# Altium project sEMG_sensor.PrjPcb
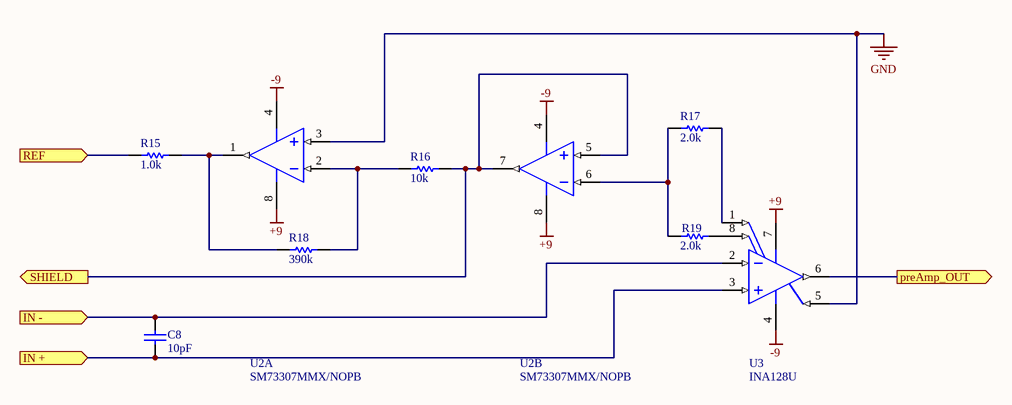
[diagram p0: PreAmplifier.SchDoc]
2 sheets, 29 parts. Net scope: flat (ports and power ports of the same name join across sheets).
Board file: sEMG_sensor_V1.PcbDoc
Sheets:
  PreAmplifier.SchDoc
  BandPassFilter.SchDoc

## Sheet PreAmplifier.SchDoc
size A

### Parts
C8  value 10pF  [0402cap]  (hidden comment: C0402)
R15  value 1.0k  [0402RES]  (hidden comment: R0402)
R16  value 10k  [0402RES]  (hidden comment: R0402)
R17  value 2.0k  [0402RES]  (hidden comment: R0402)
R18  value 390k  [0402RES]  (hidden comment: R0402)
R19  value 2.0k  [0402RES]  (hidden comment: R0402)
U2  SM73307MMX/NOPB  [MUA08A_N]  (parts A,B of 2)
U3  INA128U  [TI-D8_N]

### Ports
IN + (in), IN - (in), preAmp_OUT (out), REF (in), SHIELD (out)

### Nets
+9: U2.8(V+) U3.7(V+)
-9: U2.4(V-) U3.4(V-)
GND: U2.3(INA+) U3.5(REF)
NetC4_2: U3.6(VO) ; port preAmp_OUT
NetC8_1: C8.1 U3.3(VIN+) ; port IN +
NetC8_2: C8.2 U3.2(VIN-) ; port IN -
NetR15_1: R15.1 ; port REF
NetR15_2: R15.2 R18.1 U2.1(OUTA)
NetR16_1: R16.1 R18.2 U2.2(INA-)
NetR16_2: R16.2 U2.5(INB+) U2.7(OUTB) ; port SHIELD
NetR17_1: R17.1 R19.1 U2.6(INB-)
NetR17_2: R17.2 U3.1(RG)
NetR19_2: R19.2 U3.8(RG)

### Library data of the parts
C8 = C0402: 0402 Ceramic Chip Capacitor - Standard
R15-R19 = R0402: 0402 Chip Resistor - Standard; ComponentLink1URL: *
U2 = SM73307MMX/NOPB: Dual Precision, 17 MHz, Low Noise, CMOS Input Amplifier, 8-pin Mini SOIC, 3500 Reel; Manufacturer: National Semiconductor; PackageTopMarking: ZXTT*S307; PowerWise: N; CompType: Amplifiers; High-Reliability: Y; DatasheetVersion: Jun-2011; PackageVersion: revF, Apr-2008; PackageReference: MUA08A; PackageDescription: MINI SOIC, .118 x .118 x .034in, 8 Lead, .0256in Pitch; PartNumber: SM73307MMX/NOPB; RoHS: Y; PinCount: 8; Code_JEDEC: MO-187-AA; ComponentLink1Description: Manufacturer URL; ComponentLink1URL: http://www.national.com/; ComponentLink2Description: SM73307 Datasheet; ComponentLink2URL: http://www.national.com/ds/SM/SM73307.pdf; ComponentLink3Description: SM73307 Web Page; ComponentLink3URL: http://www.national.com/pf/SM/SM73307.html; ComponentLink4Description: MUA08A Package Page; ComponentLink4URL: http://www.national.com/packaging/folders/mua08a.html
U3 = INA128U: Precision, Low Power Instrumentation Amplifier, -40 to 85 degC, 8-pin SOIC (D8), Green (RoHS & no Sb/Br); Manufacturer: Texas Instruments; CMRR(Min)(dB): 120; Gain(V/V): 1 to 10000; Input Bias Current (+/-)(Max)(nA): 5; Input Offset (+/-)(Max)(uV): 50; Input Offset Drift (+/-)(Max)(uV/Degrees Celsius): 0.5; Noise at 1kHz(Typ)(nV/rt(Hz)): 8; Non-Linearity (+/-)(Max)(%): 0.002; Number of Channels: 1; Quiescent Current (+/-)(Typ)(mA): 0.7; SubFamily: Dual Supply; Vs(Max)(V): 36; Vs(Min)(V): 4.5; DatasheetVersion: SBOS051B; PackageVersion: 4040047-3/M, 06/2011; PackageReference: D8; PackageDescription: 8-Pin Plastic Small Outline, Body 4.9 x 3.9 mm, Pitch 1.27 mm; Supplier 1: Digi-Key; Supplier Part Number 1: INA128U-ND; Supplier 2: Farnell; Supplier Part Number 2: 1212413; Supplier 3: Newark; Supplier Part Number 3: 35C1729; Supplier 4: Mouser; Supplier Part Number 4: 595-INA128U; Eco-Plan: Green (RoHS & no Sb/Br); Mounting Technology: Surface Mount; Code_JEDEC: MS-012; PartNumber: INA128U; ComponentLink1Description: Manufacturer URL; ComponentLink1URL: http://www.ti.com/; ComponentLink2Description: Datasheet; ComponentLink2URL: http://www.ti.com/general/docs/lit/getliterature.tsp?genericPartNumber=INA128&fileType=pdf; ComponentLink3Description: Package Specification; ComponentLink3URL: http://www.ti.com/litv/pdf/msoi002j

## Sheet BandPassFilter.SchDoc
size A
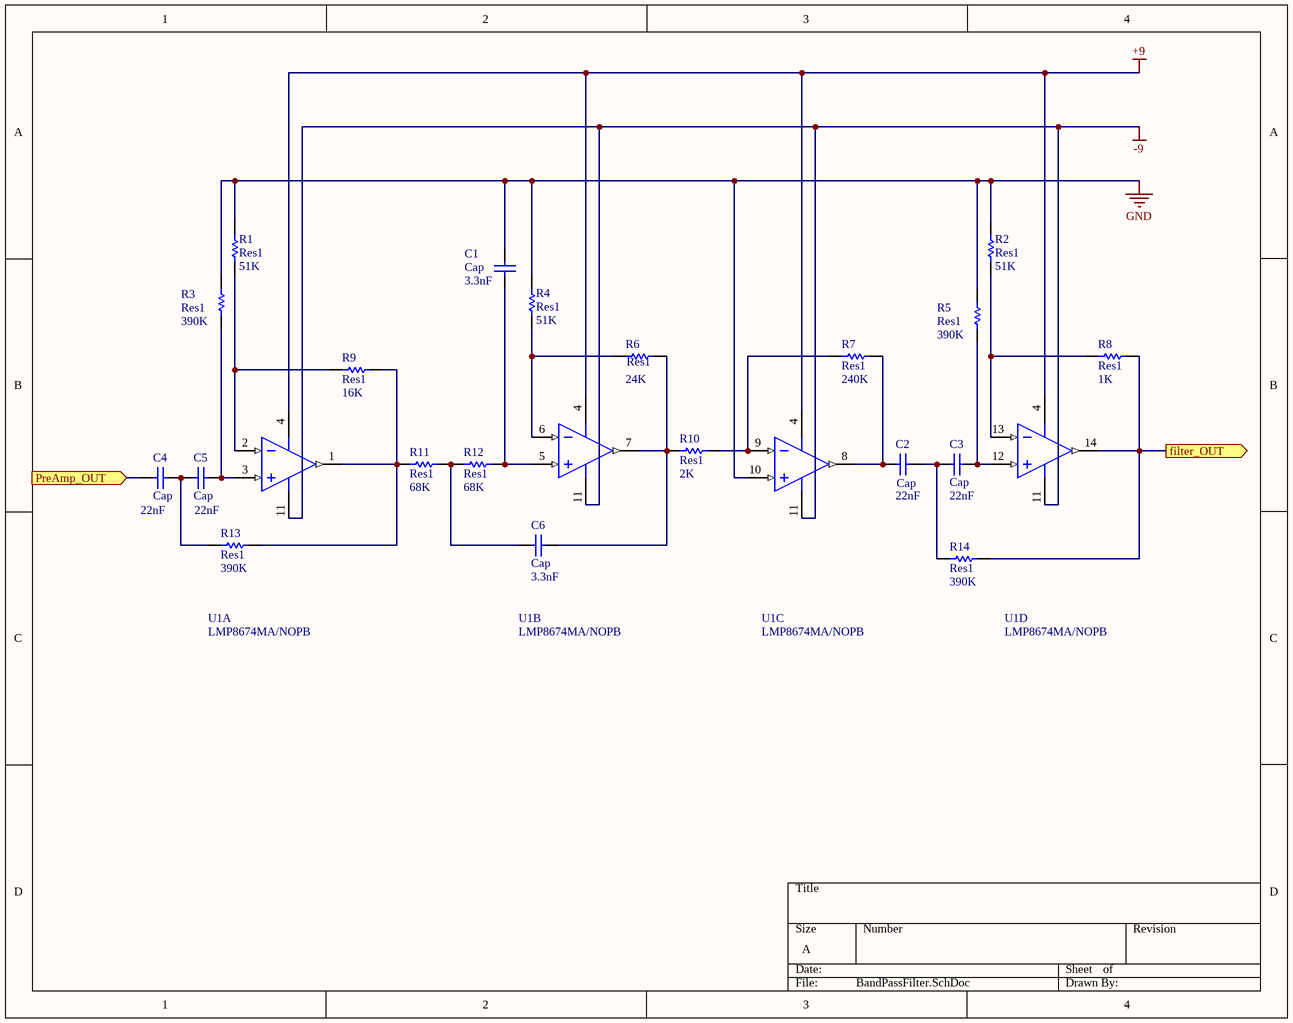
[diagram p1: BandPassFilter.SchDoc]

### Parts
C1  Cap  value 3.3nF  [C0805]
C2  Cap  value 22nF  [C0805]
C3  Cap  value 22nF  [C0805]
C4  Cap  value 22nF  [C0805]
C5  Cap  value 22nF  [C0805]
C6  Cap  value 3.3nF  [C0805]
R1  Res1  value 51K  [6-0805_L]
R2  Res1  value 51K  [6-0805_L]
R3  Res1  value 390K  [6-0805_L]
R4  Res1  value 51K  [6-0805_L]
R5  Res1  value 390K  [6-0805_L]
R6  Res1  value 24K  [6-0805_L]
R7  Res1  value 240K  [6-0805_L]
R8  Res1  value 1K  [6-0805_L]
R9  Res1  value 16K  [6-0805_L]
R10  Res1  value 2K  [6-0805_L]
R11  Res1  value 68K  [6-0805_L]
R12  Res1  value 68K  [6-0805_L]
R13  Res1  value 390K  [6-0805_L]
R14  Res1  value 390K  [6-0805_L]
U1  LMP8674MA/NOPB  [M14A_N]  (parts A,B,C,D of 4)

### Ports
filter_OUT (out), PreAmp_OUT (in)

### Nets
+9: U1.4(V+)
-9: U1.11(V-)
GND: C1.1 R1.2 R2.2 R3.2 R4.1 R5.2 U1.10(IN3+)
NetC1_2: C1.2 R12.1 U1.5(IN2+)
NetC2_1: C2.1 R7.2 U1.8(OUT3)
NetC2_2: C2.2 C3.1 R14.2
NetC3_2: C3.2 R5.1 U1.12(IN4+)
NetC4_1: C4.1 C5.2 R13.1
NetC4_2: C4.2 ; port PreAmp_OUT
NetC5_1: C5.1 R3.1 U1.3(IN1+)
NetC6_1: C6.1 R6.2 R10.1 U1.7(OUT2)
NetC6_2: C6.2 R11.1 R12.2
NetR1_1: R1.1 R9.1 U1.2(IN1-)
NetR2_1: R2.1 R8.2 U1.13(IN4-)
NetR4_2: R4.2 R6.1 U1.6(IN2-)
NetR7_1: R7.1 R10.2 U1.9(IN3-)
NetR8_1: R8.1 R14.1 U1.14(OUT4) ; port filter_OUT
NetR9_2: R9.2 R11.2 R13.2 U1.1(OUT1)

### Library data of the parts
C1-C6 = Cap: Capacitor; Published: 8-Jun-2000; LatestRevisionDate: 17-Jul-2002; LatestRevisionNote: Re-released for DXP Platform.; PackageReference: RAD-0.3; Publisher: Altium Limited; PackageDescription: Radial Cap, Thru-Hole; 2 Leads; 0.3 in Pin Spacing
R1-R14 = Res1: Resistor; Published: 8-Jun-2000; LatestRevisionDate: 17-Jul-2002; LatestRevisionNote: Re-released for DXP Platform.; PackageReference: AXIAL-0.3; Publisher: Altium Limited; PackageDescription: Axial Device, Thru-Hole; 2 Leads; 0.3 in Pin Spacing
U1 = LMP8674MA/NOPB: Quad 40V Low Noise Precision Amplifier, 14-pin Narrow SOIC, 55 Rail; Manufacturer: National Semiconductor; PackageTopMarking: NSUZXYTTE#*LMP8674*MA; PowerWise: N; CompType: Amplifiers; High-Reliability: Y; DatasheetVersion: Jul-2011; PackageVersion: revJ, Jan-1996; PackageReference: M14A; PackageDescription: Molded Package S.O., .150in Wide, 14 Lead; PartNumber: LMP8674MA/NOPB; RoHS: Y; PinCount: 14; Code_JEDEC: MS-012AB; Code_IPC: SOIC127P600-14; ComponentLink1Description: Manufacturer URL; ComponentLink1URL: http://www.national.com/; ComponentLink2Description: LMP8674 Datasheet; ComponentLink2URL: http://www.national.com/ds/LM/LMP8674.pdf; ComponentLink3Description: LMP8674 Web Page; ComponentLink3URL: http://www.national.com/pf/LM/LMP8674.html; ComponentLink4Description: M14A Package Page; ComponentLink4URL: http://www.national.com/packaging/folders/m14a.html

## Nets that join several sheets
+9: PreAmplifier (U2.8 U3.7), BandPassFilter (U1.4)
-9: PreAmplifier (U2.4 U3.4), BandPassFilter (U1.11)
GND: PreAmplifier (U2.3 U3.5), BandPassFilter (7 pins)
NetC4_2: PreAmplifier (U3.6), BandPassFilter (C4.2)